# EAGLE design AD7771Breakout (EAGLE 9.6.2)
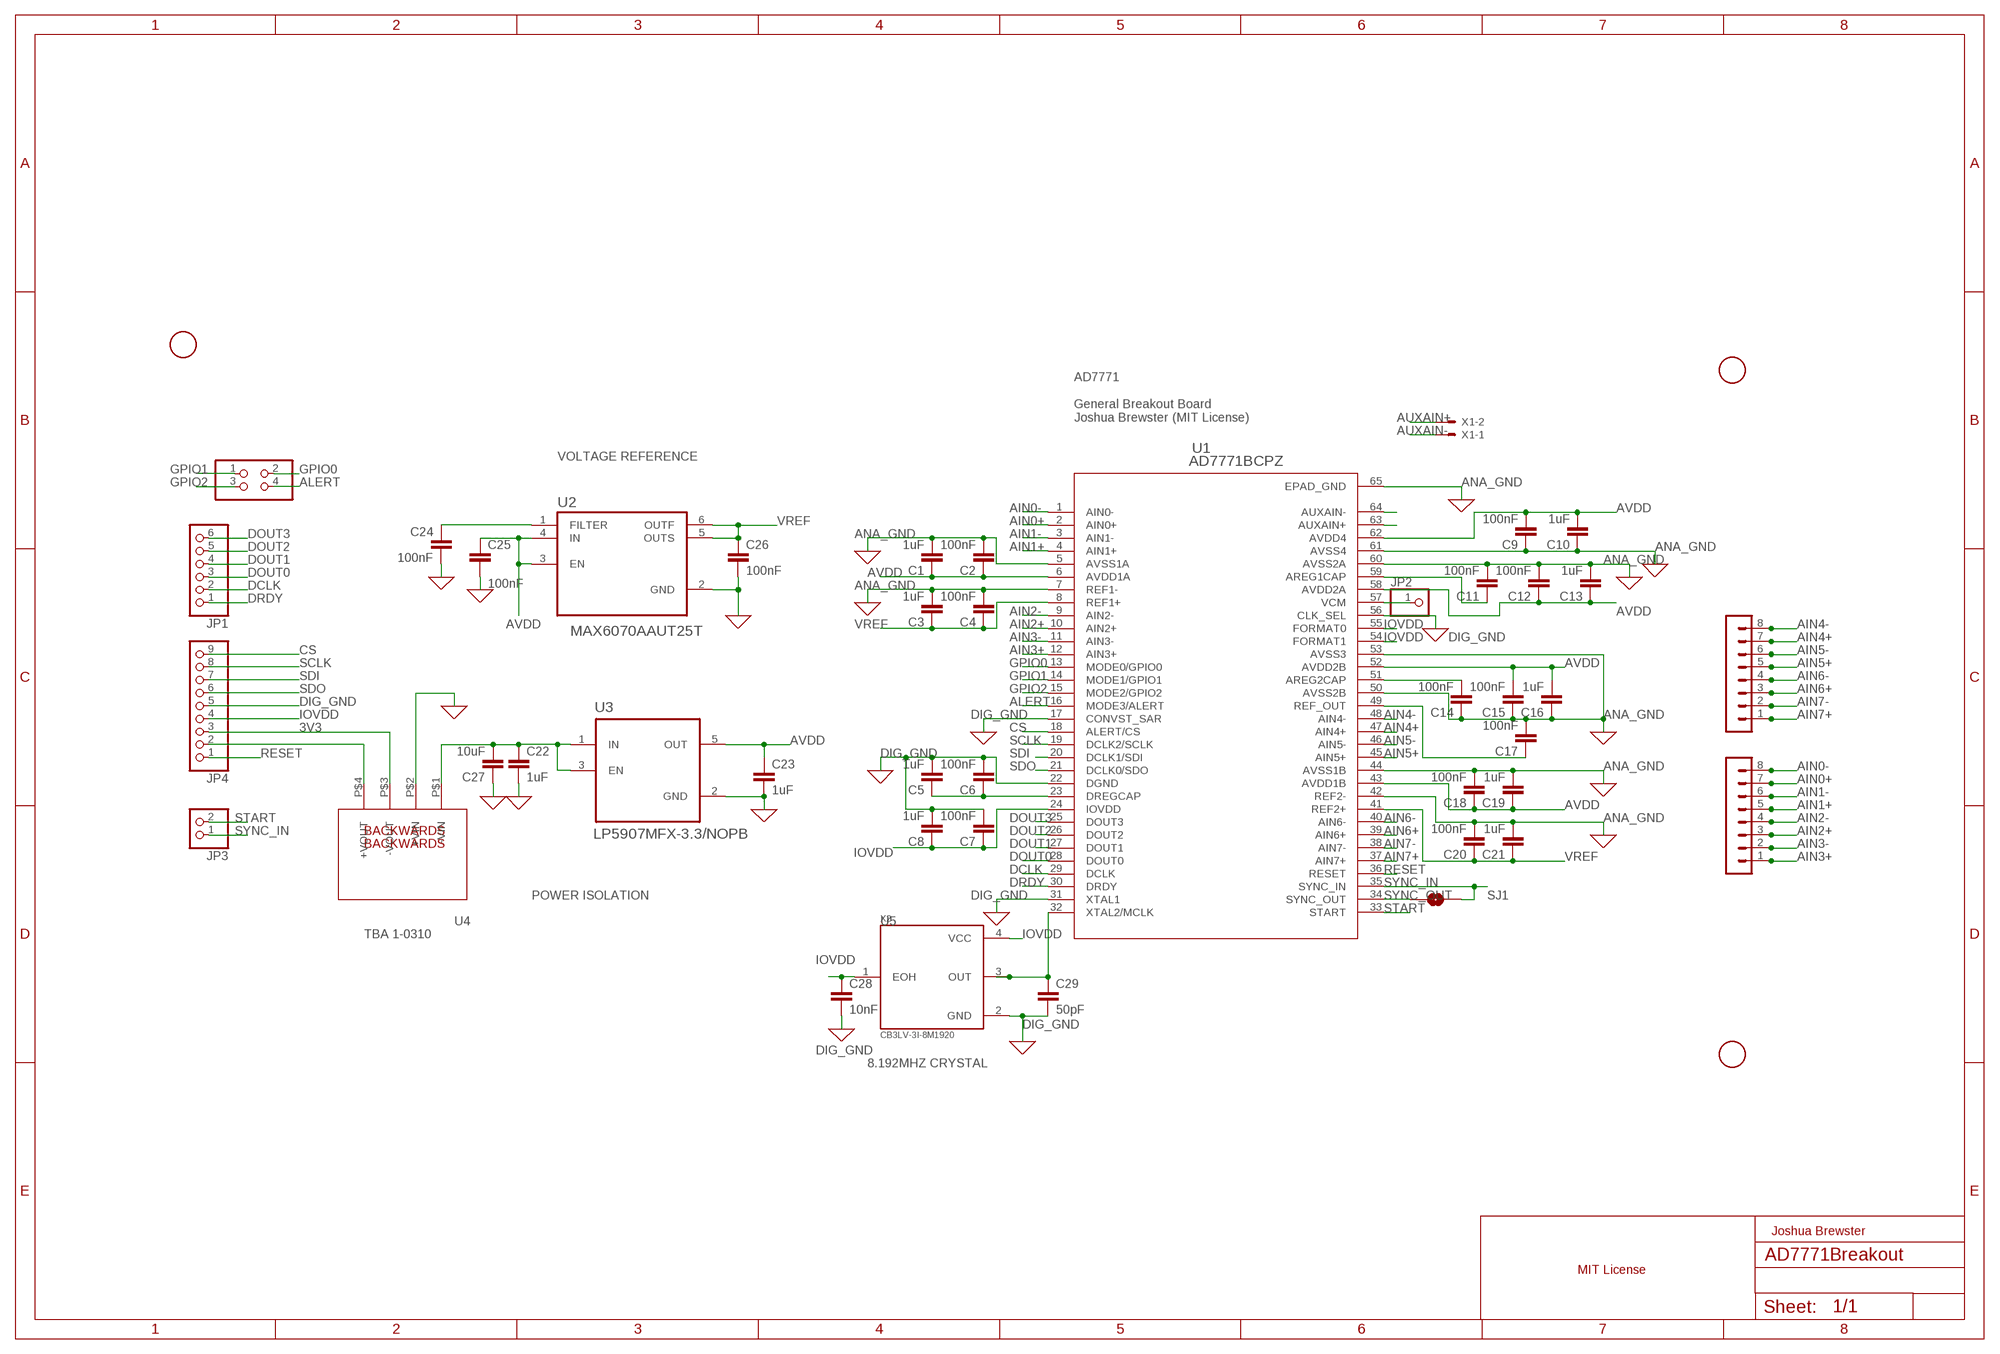
[diagram p0: schematic, sheet 1]

## Parts
C1  1uF  C-EUC0402  [C0402]
C2  100nF  C-EUC0402  [C0402]
C3  1uF  C-EUC0402  [C0402]
C4  100nF  C-EUC0402  [C0402]
C5  1uF  C-EUC0402  [C0402]
C6  100nF  C-EUC0402  [C0402]
C7  100nF  C-EUC0402  [C0402]
C8  1uF  C-EUC0402  [C0402]
C9  100nF  C-EUC0402  [C0402]
C10  1uF  C-EUC0402  [C0402]
C11  100nF  C-EUC0402  [C0402]
C12  100nF  C-EUC0402  [C0402]
C13  1uF  C-EUC0402  [C0402]
C14  100nF  C-EUC0402  [C0402]
C15  100nF  C-EUC0402  [C0402]
C16  1uF  C-EUC0402  [C0402]
C17  100nF  C-EUC0402  [C0402]
C18  100nF  C-EUC0402  [C0402]
C19  1uF  C-EUC0402  [C0402]
C20  100nF  C-EUC0402  [C0402]
C21  1uF  C-EUC0402  [C0402]
C22  1uF  C-EUC0402  [C0402]
C23  1uF  C-EUC0402  [C0402]
C24  100nF  C-EUC0402  [C0402]
C25  100nF  C-EUC0402  [C0402]
C26  100nF  C-EUC0402  [C0402]
C27  10uF  C-EUC0402  [C0402]
C28  10nF  C-EUC0402  [C0402]
C29  50pF  C-EUC0603  [C0603]
JP1  PINHD-1X6  [1X06]
JP2  PINHD-1X1  [1X01]
JP3  PINHD-1X2  [1X02]
JP4  PINHD-1X9  [1X09]
JP5  PINHD-2X2  [2X02]
SJ1  SOLDERJUMPERNC  [SJ_2S_SMALL]
SV4  MA08-1  [MA08-1]
SV5  MA08-1  [MA08-1]
U1  AD7771BCPZ  [CP_64_15_ADI]
U2  MAX6070AAUT25T  [SOT95P280X145-6N]
U3  LP5907MFX-3.3/NOPB  [SOT95P280X145-5N]
U4  TBA1-0310  [SIP4-KT]
U$1  FIDUCIAL  [FIDUCIAL_1MM]
U$2  FIDUCIAL  [FIDUCIAL_1MM]
U$5  FIDUCIAL  [FIDUCIAL_1MM]
X1  332-02  [332-02]
X2  CB3LV-3I-8M1920  [OSCCC700X500X180-4N]

## Nets
3V3: JP4.3 U4.P$3(-VOUT)
AGND_OUT: JP4.2 U4.P$4(+VOUT)
AIN0+: SV4.7 U1.2(AIN0+)
AIN0-: SV4.8 U1.1(AIN0-)
AIN1+: SV4.5 U1.4(AIN1+)
AIN1-: SV4.6 U1.3(AIN1-)
AIN2+: SV4.3 U1.10(AIN2+)
AIN2-: SV4.4 U1.9(AIN2-)
AIN3+: SV4.1 U1.12(AIN3+)
AIN3-: SV4.2 U1.11(AIN3-)
AIN4+: SV5.7 U1.47(AIN4+)
AIN4-: SV5.8 U1.48(AIN4-)
AIN5+: SV5.5 U1.45(AIN5+)
AIN5-: SV5.6 U1.46(AIN5-)
AIN6+: SV5.3 U1.39(AIN6+)
AIN6-: SV5.4 U1.40(AIN6-)
AIN7+: SV5.1 U1.37(AIN7+)
AIN7-: SV5.2 U1.38(AIN7-)
ALERT: JP5.4 U1.16(MODE3/ALERT)
ANA_GND: C1.2 C2.2 C3.2 C4.2 C9.1 C10.1 C11.2 C12.2 C13.2 C14.1 C15.1 C16.1 C17.2 C18.2 C19.2 C20.2 C21.2 C22.2 C23.2 C24.2 C25.2 C26.2 C27.1 U1.5(AVSS1A) U1.7(REF1-) U1.42(REF2-) U1.44(AVSS1B) U1.50(AVSS2B) U1.53(AVSS3) U1.60(AVSS2A) U1.61(AVSS4) U1.65(EPAD_GND) U2.2(GND) U3.2(GND) U4.P$2(+VIN) ; supply symbol labelled GND
AREG1CAP: C11.1 U1.59(AREG1CAP)
AREG2CAP: C14.2 U1.51(AREG2CAP)
AUXAIN+: U1.63(AUXAIN+) X1.2
AUXAIN-: U1.64(AUXAIN-) X1.1
AVDD: C1.1 C2.1 C9.2 C10.2 C12.1 C13.1 C15.2 C16.2 C18.1 C19.1 C23.1 C25.1 U1.6(AVDD1A) U1.43(AVDD1B) U1.52(AVDD2B) U1.58(AVDD2A) U1.62(AVDD4) U2.3(EN) U2.4(IN) U3.5(OUT)
CS: JP4.9 U1.18(ALERT/CS)
DCLK: JP1.2 U1.29(DCLK)
DIG_GND: C5.2 C6.2 C7.2 C8.2 C28.2 C29.2 JP4.5 U1.17(CONVST_SAR) U1.22(DGND) U1.31(XTAL1) U1.56(CLK_SEL) X2.2(GND) ; supply symbol labelled GND
DOUT0: JP1.3 U1.28(DOUT0)
DOUT1: JP1.4 U1.27(DOUT1)
DOUT2: JP1.5 U1.26(DOUT2)
DOUT3: JP1.6 U1.25(DOUT3)
DRDY: JP1.1 U1.30(DRDY)
DREGCAP: C5.1 C6.1 U1.23(DREGCAP)
FILTER: C24.1 U2.1(FILTER)
GPIO0: JP5.2 U1.13(MODE0/GPIO0)
GPIO1: JP5.1 U1.14(MODE1/GPIO1)
GPIO2: JP5.3 U1.15(MODE2/GPIO2)
IOVDD: C7.1 C8.1 C28.1 JP4.4 U1.24(IOVDD) U1.54(FORMAT1) U1.55(FORMAT0) X2.1(EOH) X2.4(VCC)
REF_OUT: C17.1 U1.49(REF_OUT)
RESET: JP4.1 U1.36(RESET)
SCLK: JP4.8 U1.19(DCLK2/SCLK)
SDI: JP4.7 U1.20(DCLK1/SDI)
SDO: JP4.6 U1.21(DCLK0/SDO)
START: JP3.2 U1.33(START)
SYNC_IN: JP3.1 SJ1.2 U1.35(SYNC_IN)
SYNC_OUT: SJ1.1 U1.34(SYNC_OUT)
VCM: JP2.1 U1.57(VCM)
VOUT+: C22.1 C27.2 U3.1(IN) U3.3(EN) U4.P$1(-VIN)
VREF: C3.1 C4.1 C20.1 C21.1 C26.1 U1.8(REF1+) U1.41(REF2+) U2.5(OUTS) U2.6(OUTF)
XTAL2: C29.1 U1.32(XTAL2/MCLK) X2.3(OUT)

## Notes on the sheet
- AD7771
  
  General Breakout Board 
  Joshua Brewster (MIT License)
- VOLTAGE REFERENCE
- BACKWARDS
- BACKWARDS
- POWER ISOLATION
- U4 | U5
- TBA 1-0310
- 8.192MHZ CRYSTAL
- Joshua Brewster
- MIT License

## Library data of the parts
C1-C29 = rcl:C-EU: CAPACITOR, European symbol; SPICEPREFIX: C
JP1 = pinhead:PINHD-1X6: PIN HEADER
JP2 = pinhead:PINHD-1X1: PIN HEADER
JP3 = pinhead:PINHD-1X2: PIN HEADER
JP4 = pinhead:PINHD-1X9: PIN HEADER
JP5 = pinhead:PINHD-2X2: PIN HEADER
SJ1 = headers:SOLDERJUMPER: Solder Jumper Standard SMD solder jumper. Used to automate production. Two varients : Normally Open and Normally Closed are the same, but have different paste layers. NC will have a large amount of paste and should jumper during reflow.
SV4 SV5 = con-lstb:MA08-1: PIN HEADER; OC_FARNELL: unknown; OC_NEWARK: unknown
U1 = AD7771:AD7771BCPZ; BUILT_BY: Analog Devices Inc.; MANUFACTURER_PART_NUMBER: AD7771BCPZ; SOURCELIBRARY: Analog_2017-10-24; VENDOR: Analog Devices Inc
U2 = MAX6070AAUT25T:MAX6070AAUT25T; AVAILABILITY: Unavailable; DESCRIPTION: Series Voltage Reference IC ±0.04% SOT-23-6; MF: Maxim Integrated; MP: MAX6070AAUT25+; PACKAGE: SOT-6 Maxim; PRICE: None
U3 = LP5907MFX-3.3_NOPB:LP5907MFX-3.3/NOPB: IC REG LINEAR 3.3V 250MA SOT23; AVAILABILITY: Unavailable; DESCRIPTION: Linear Voltage Regulator IC 1 Output 250mA SOT-23-5; MF: Texas Instruments; MP: LP5907MFX-3.3/NOPB; PACKAGE: SOT-23 Texas Instruments; PRICE: None
U4 = TBA1-0310:TBA1-0310
U$1 U$2 U$5 = adafruit:FIDUCIAL: For use by pick and place machines to calibrate the vision/machine, 1mm By microbuilder.eu
X1 = con-garry:332-02: 2 Pin - 2mm Dual Row Source: www.mpe-connector.de / garry_shortform_2012.pdf
X2 = CB3LV-3I-8M1920:CB3LV-3I-8M1920: Oscillator XO 50MHz 50ppm 50pF HCMOS/TTL 55% 3.3V 4-Pin SMD T/R; AVAILABILITY: Unavailable; DESCRIPTION: 8.192MHz XO _Standard_ HCMOS, TTL Oscillator 3.3V Enable/Disable 4-SMD, No Lead; MF: CTS-Frequency; MP: CB3LV-3I-8M1920; PACKAGE: SMD-4 CTS Components; PRICE: None

## Board
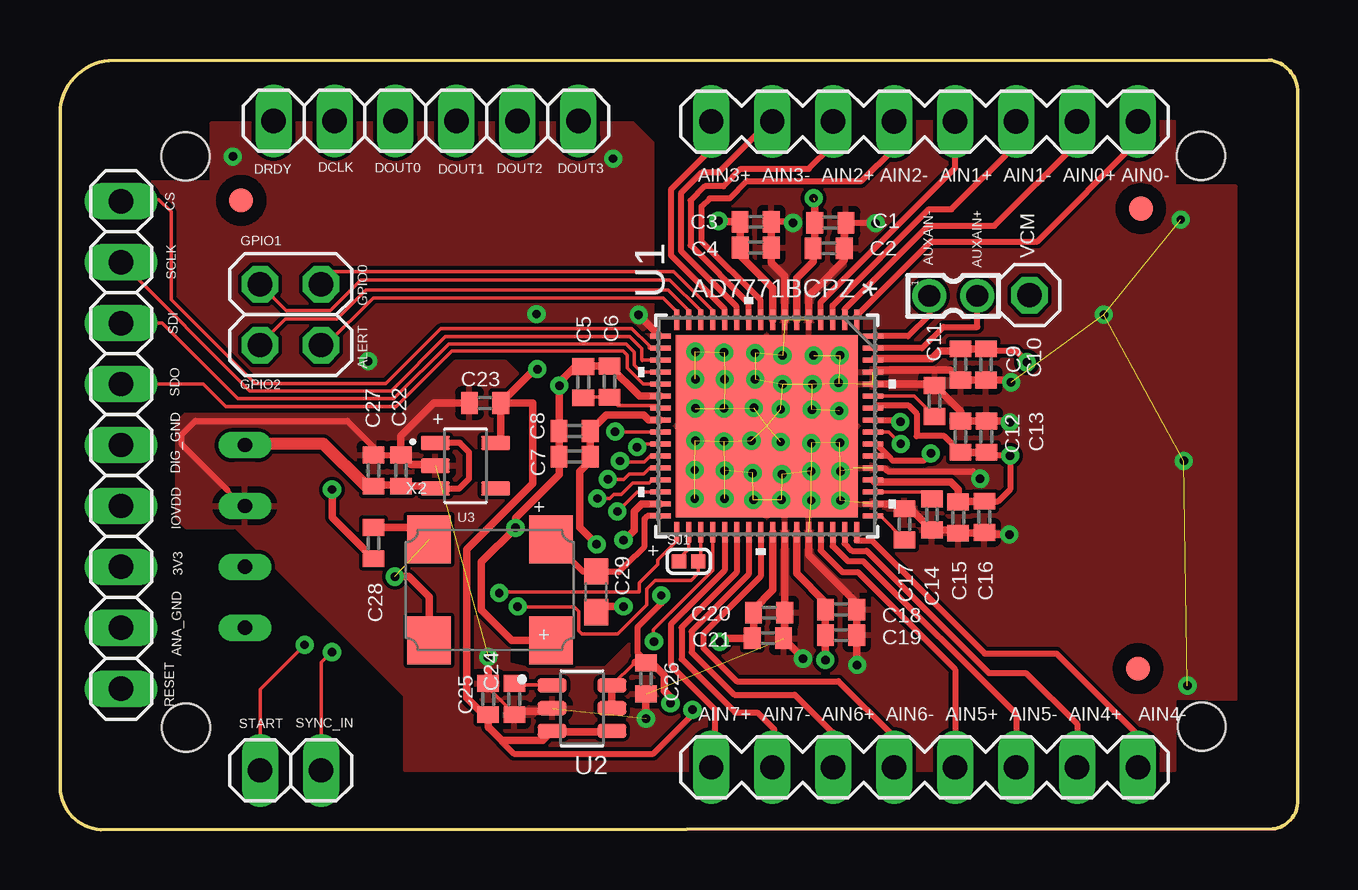
[diagram p1: board, top side]
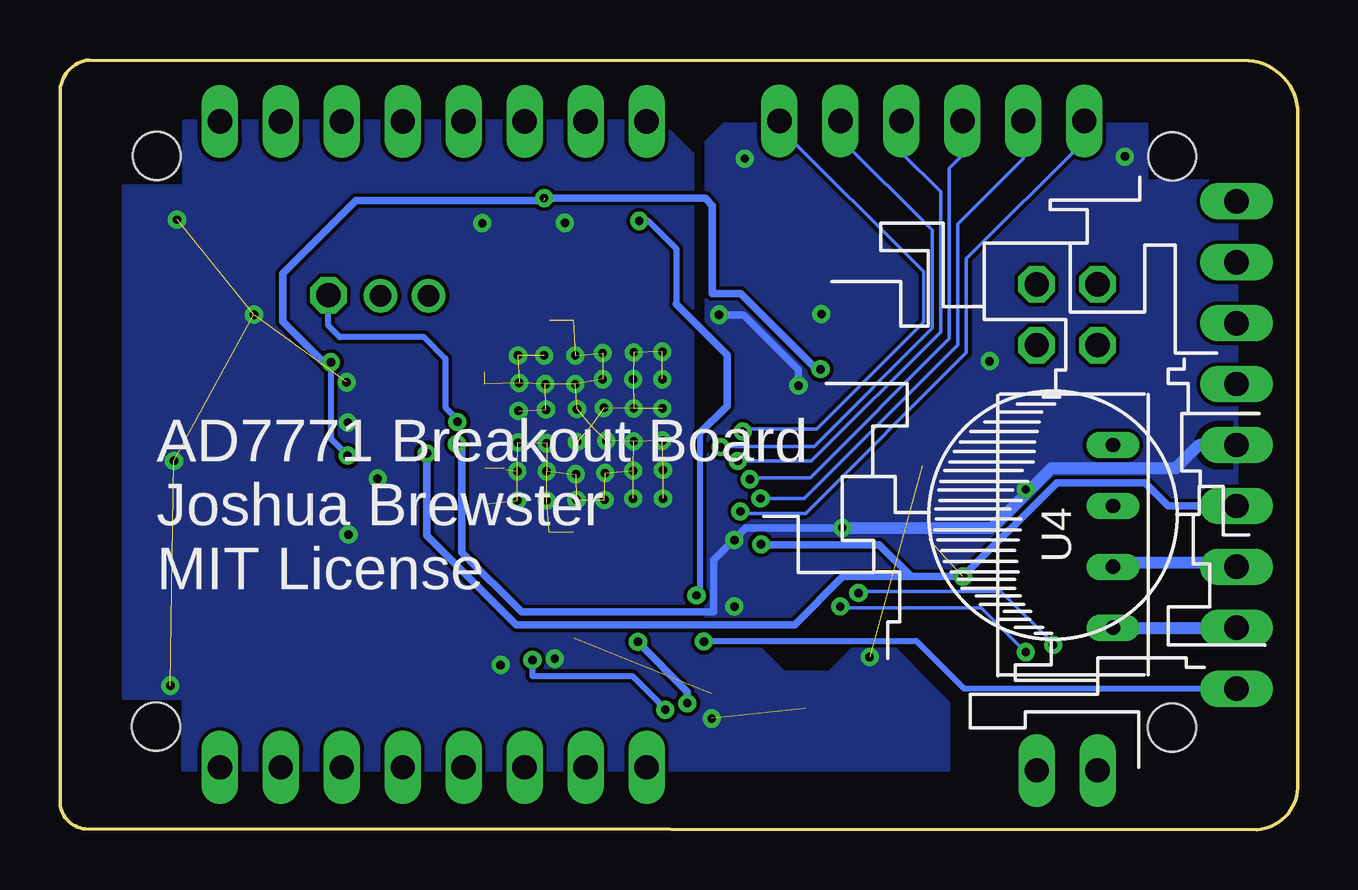
[diagram p2: board, bottom side, seen from below]

Size 51.58 x 32.09 mm. Coordinates in mm from the lower left corner, seen from the top.
Outline: 1.7,0 50.53,0.03 arc90 51.57,1.32 51.57,30.58 arc90 50.36,32.09 2.04,32.06 arc90 0.01,29.65 0.01,1.91 arc90 1.7,0
Copper layers (1*16): Top 0.035mm / dielectric 1.5mm / Bottom 0.035mm
Design rules "default *": minimum track width 6mil, minimum drill 0.3mm, track to track 6mil, track to pad 6mil, pad to pad 6mil, via to via 6mil, smd to smd 6mil, copper to edge 0mil, drill to drill 6mil, minimum pad ring 10mil, minimum via ring 8mil, stop-mask expansion 4mil, vias tented up to drill 0mil, thermal gap 10mil
Holes 2 mm at 47.57,4.3 47.54,28.08 5.23,28.06 5.25,4.26

### Footprints (pad centres in the part's own frame; a part is rotated, then mirrored left to right if it is on the bottom)
C0402 = smd 0.7 x 0.9: 1 -0.65,0; 2 0.65,0
C0603 = smd 1.1 x 1: 1 -0.85,0; 2 0.85,0
1X06 = drill 1.016 long: 1 -6.35,0; 2 -3.81,0; 3 -1.27,0; 4 1.27,0; 5 3.81,0; 6 6.35,0
1X01 = drill 1.016 octagon: 1 0,0
1X02 = drill 1.016 long: 1 -1.27,0; 2 1.27,0
1X09 = drill 1.016 long: 1 -10.16,0; 2 -7.62,0; 3 -5.08,0; 4 -2.54,0; 5 0,0; 6 2.54,0; 7 5.08,0; 8 7.62,0; 9 10.16,0
2X02 = drill 1.016 octagon: 1 -1.27,-1.27; 2 -1.27,1.27; 3 1.27,-1.27; 4 1.27,1.27
SJ_2S_SMALL = smd 0.6 x 0.6: 1 -0.4,0; 2 0.4,0
MA08-1 = drill 1.016 long: 1 -8.89,0; 2 -6.35,0; 3 -3.81,0; 4 -1.27,0; 5 1.27,0; 6 3.81,0; 7 6.35,0; 8 8.89,0
CP_64_15_ADI = smd 0.855 x 0.198: 1 -4.427,3.75; 2 -4.427,3.25; 3 -4.427,2.75; 4 -4.427,2.25; 5 -4.427,1.75; 6 -4.427,1.25; 7 -4.427,0.75; 8 -4.427,0.25; 9 -4.427,-0.25; 10 -4.427,-0.75; 11 -4.427,-1.25; 12 -4.427,-1.75; 13 -4.427,-2.25; 14 -4.427,-2.75; 15 -4.427,-3.25; 16 -4.427,-3.75; 33 4.427,-3.75; 34 4.427,-3.25; 35 4.427,-2.75; 36 4.427,-2.25; 37 4.427,-1.75; 38 4.427,-1.25; 39 4.427,-0.75; 40 4.427,-0.25; 41 4.427,0.25; 42 4.427,0.75; 43 4.427,1.25; 44 4.427,1.75; 45 4.427,2.25; 46 4.427,2.75; 47 4.427,3.25; 48 4.427,3.75 | smd 0.198 x 0.855: 17 -3.75,-4.427; 18 -3.25,-4.427; 19 -2.75,-4.427; 20 -2.25,-4.427; 21 -1.75,-4.427; 22 -1.25,-4.427; 23 -0.75,-4.427; 24 -0.25,-4.427; 25 0.25,-4.427; 26 0.75,-4.427; 27 1.25,-4.427; 28 1.75,-4.427; 29 2.25,-4.427; 30 2.75,-4.427; 31 3.25,-4.427; 32 3.75,-4.427; 49 3.75,4.427; 50 3.25,4.427; 51 2.75,4.427; 52 2.25,4.427; 53 1.75,4.427; 54 1.25,4.427; 55 0.75,4.427; 56 0.25,4.427; 57 -0.25,4.427; 58 -0.75,4.427; 59 -1.25,4.427; 60 -1.75,4.427; 61 -2.25,4.427; 62 -2.75,4.427; 63 -3.25,4.427; 64 -3.75,4.427 | smd 7.6 x 7.6: 65 0,0
SOT95P280X145-6N = smd 1.22 x 0.6: 1 -1.245,0.95; 2 -1.245,0; 3 -1.245,-0.95; 4 1.245,-0.95; 5 1.245,0; 6 1.245,0.95
SOT95P280X145-5N = smd 1.21 x 0.59: 1 -1.255,0.95; 2 -1.255,0; 3 -1.255,-0.95; 4 1.255,-0.95; 5 1.255,0.95
SIP4-KT = drill 0.6 pad 0.813 long: P$1 -5.08,0; P$2 -2.54,0; P$3 0,0; P$4 2.54,0
FIDUCIAL_1MM = smd 1 x 1: 1 0,0
332-02 = drill 0.9 pad 1.27: 1 0,-1; 2 0,1
OSCCC700X500X180-4N = smd 1.8 x 2: 1 -2.54,-2.1; 2 2.54,-2.1; 3 2.54,2.1; 4 -2.54,2.1

### Placement (x,y rotation side)
C1  32.1,25.3 0 top
C2  32.03,24.23 0 top
C3  28.98,25.34 0 top
C4  28.99,24.26 0 top
C5  21.8,18.65 90 top
C6  22.89,18.67 90 top
C7  21.45,15.55 180 top
C8  21.45,16.62 180 top
C9  37.52,19.39 90 top
C10  38.58,19.39 90 top
C11  36.44,17.87 90 top
C12  37.52,16.38 90 top
C13  38.6,16.38 90 top
C14  36.33,13.14 90 top
C15  37.42,13.01 90 top
C16  38.51,13.04 90 top
C17  35.19,12.73 90 top
C18  32.55,9.17 0 top
C19  32.55,8.11 0 top
C20  29.55,9.05 0 top
C21  29.5,7.98 0 top
C22  14.21,14.97 90 top
C23  17.71,17.79 180 top
C24  18.93,5.44 270 top
C25  17.84,5.44 90 top
C26  24.42,6.3 270 top
C27  13.06,14.97 270 top
C28  13.06,11.94 270 top
C29  22.33,9.91 270 top
JP1  15.25,29.55 0 top
JP2  40.39,22.28 0 top
JP3  9.61,2.47 180 top
JP4  2.55,16.03 90 top
JP5  9.61,21.47 270 top
SJ1  26.2,11.18 0 top
SV4  36.03,29.52 0 top
SV5  36.03,2.6 0 top
U1  29.45,16.82 270 top
U2  21.75,5.06 0 top
U3  16.9,15.17 0 top
U4  7.7,10.95 270 bottom
U$1  45.03,25.89 0 top
U$2  44.92,6.71 0 top
U$5  7.55,26.23 0 top
X1  37.22,22.26 270 top
X2  17.92,9.99 0 top

### Tracks (layer width: path | path; a pad name or v marks a point on that pad's centre or on a via)
3V3
  Bottom 0.508: JP4.3 2.73,11.13 7.37,11.13 7.55,10.95 U4.P$3
AGND_OUT
  Bottom 0.508: 2.6,8.46 JP4.2 U4.P$4
AIN0+
  Top 0.254: U1.2 32.7,21.7 36.18,25.18 38.93,25.18 42.38,28.62 SV4.7
AIN0-
  Top 0.152: U1.1 33.2,21.43
  Top 0.254: SV4.8 44.92,28.71 40.72,24.52 36.28,24.52 33.2,21.43
AIN1+
  Top 0.254: U1.4 31.7,21.99 37.3,27.59 SV4.5
AIN1-
  Top 0.254: U1.3 32.2,21.86 36.2,25.86 37.14,25.86 39.84,28.55 SV4.6
AIN2+
  Top 0.152: SV4.3 32.13,29.43
  Top 0.254: U1.10 28.7,21.94 26.27,24.36 26.27,26.23 26.87,26.82 27.65,26.82 28.37,27.55 31.2,27.55 32.13,28.48 32.13,29.43
AIN2-
  Top 0.254: U1.9 29.2,22.07 26.73,24.54 26.73,25.98 27.07,26.31 27.9,26.31 28.62,27.03 33.39,27.03 34.76,28.4 SV4.4
AIN3+
  Top 0.152: 27.14,28.9 27.13,28.89
  Top 0.254: U1.12 27.7,21.69 25.46,23.93 25.46,26.69 27.13,28.36 27.13,28.89 | SV4.1 27.14,28.9
AIN3-
  Top 0.152: SV4.2 29.47,29.32
  Top 0.254: U1.11 28.2,21.8 25.87,24.14 25.87,26.53 26.73,27.39 27.43,27.39 29.36,29.32 29.47,29.32
AIN4+
  Top 0.254: U1.47 32.7,11.92 32.99,11.63 33.61,11.63 38.7,6.53 40.24,6.53 42.38,4.4 SV5.7
AIN4-
  Top 0.254: U1.48 33.2,12.04 33.83,12.04 38.53,7.35 41.52,7.35 44.92,3.95 SV5.8
AIN5+
  Top 0.254: U1.45 31.7,11.64 32.6,10.74 33.24,10.74 37.3,6.68 SV5.5
AIN5-
  Top 0.254: U1.46 32.2,11.82 32.83,11.19 33.46,11.19 39.84,4.82 SV5.6
AIN6+
  Top 0.254: U1.39 28.7,10.63 26.32,8.25 26.32,7.4 28.1,5.62 30.61,5.62 32.22,4.01
  Top 0.305: 32.22,4.01 SV5.3
AIN6-
  Top 0.254: U1.40 29.2,10.55 26.81,8.15 26.81,7.57 28.2,6.18 32.43,6.18 34.76,3.86
  Top 0.305: 34.76,3.86 SV5.4
AIN7+
  Top 0.152: 27.28,2.74 SV5.1
  Top 0.254: U1.37 27.7,10.8 25.46,8.56 25.46,6.84 27.28,5.02 27.28,2.74
AIN7-
  Top 0.152: 29.78,4.15 29.78,2.7 SV5.2
  Top 0.254: U1.38 28.2,10.72 25.9,8.42 25.9,7.11 28.13,4.88 29.05,4.88 29.78,4.15
ALERT
  Top 0.152: U1.16 25.7,21.6 25.14,22.16 13.04,22.16 11.08,20.2 JP5.4
ANA_GND  (via drill 0.35)  (52 unrouted)
  Top 0.152: 31.61,22.66 | C2.2 32.68,23.73 | C3.2 | U1.61 33.95,19.07 | 36.39,18.57 C11.2 | 37.3,12.49 C15.1 | 38.49,12.36 C16.1 38.6,12.3 | U1.50 | 33.06,15.07 33,15.02 | 14.56,15.27 C22.2 | 19.08,4.94 C24.2 | C20.2 | 39.54,18.74 v39.63,18.65 | 18.93,4.82 17.84,5.91 C25.2 | 33.2,6.88 v33.22,6.86 | 24.4,4.64 v24.42,4.63 | C18.2 33.2,9.45 | C27.1 13.39,15.62 | 6.97,14.15 7.63,13.49 U4.P$2
  Top 0.254: C22.2 13.39,15.62 11.97,17.04 5.64,17.04 5.08,16.47 5.08,16.05 6.97,14.15 | v30.54,25.3 30.5,25.34 C3.2 | v33.98,25.28 33.96,25.3 C1.2 | U1.53 34.36,15.07 34.49,14.94 38.03,14.94 v38.34,14.63
  Top 0.305: U1.5 31.2,22.25 31.61,22.66 32.68,23.73 | U1.7 30.2,23.08 29.64,23.64 C4.2 C3.2 | C1.2 32.68,25.23 C2.2 | 33.95,19.07 34.04,19.16 37.1,19.16 C9.1 C10.1 39.54,18.74 | U1.60 36.39,18.57 | C11.2 37.52,17.43 C12.2 C13.2 39.52,17.03 v39.58,16.97 | U1.50 35.25,13.57 C14.1 | C14.1 37.3,12.49 | C15.1 38.49,12.36 | U2.2 20.38,4.94 19.08,4.94 | C18.2 C19.2 33.2,6.88 | U1.44 31.2,11.45 33.2,9.45 | U1.42 C20.2 | C20.2 30.2,8.03 C21.2 30.15,7.94 v30.96,7.13 | C23.2 15.58,17.79 14.21,16.42 C22.2 14.61,15.21 15.6,15.21 U3.2 | v39.56,12.3 38.6,12.3 | C25.2 v17.84,7.2 | C24.2 18.93,4.82 | C26.2 24.4,5.64 24.4,4.64 | C14.1 35.44,13.38 C17.2
  other vias: 31.4,19.77 26.47,19.92 26.45,14.99 26.45,13.8 26.47,18.78 27.69,13.8 26.47,17.56 26.47,16.21 30.11,19.77 28.96,19.87 27.67,19.89 27.69,18.78 27.67,17.56 27.67,16.18 27.69,14.97 28.89,13.75 28.86,14.86 28.81,16.21 28.91,17.58 28.96,18.78 30.11,18.57 30.03,17.53 30.03,16.16 30.08,14.81 30.06,13.75 31.3,13.72 31.3,14.94 31.3,16.11 32.49,16.13 32.52,14.94 32.52,13.72 32.47,17.45 32.44,18.62 31.35,18.57 31.33,17.51 32.49,19.77 43.49,21.47 46.83,15.37 46.98,6 46.7,25.43
  pour Bottom: 14.54,2.49 14.54,5.29 17.48,8.23 17.84,8.23 19.52,6.56 21.39,6.56 23.02,8.18 24.93,8.23 25.2,8.51 25.2,28.17 26.58,29.54 46.41,29.54 46.41,26.82 48.94,26.82 48.93,5.47 46.45,5.47 46.46,3.15 46.46,2.49
  pour Top: 48.98,26.82 46.42,26.82 46.42,29.53 26.58,29.52 25.15,28.1 25.15,9.17 22.72,6.74 19.44,6.74 18.73,6.91 18.7,6.94 18.7,13.14 19.74,14.18 19.74,18.34 18.58,19.51 16.44,19.51 14.23,17.3 5.19,17.3 4.86,16.97 4.86,12.98 5.24,12.6 7.32,12.6 14.36,5.57 14.36,2.46 46.38,2.48 46.44,2.48 46.44,5.46 48.98,5.43
AREG1CAP
  Top 0.152: U1.59 35.59,18.07 C11.1
AREG2CAP
  Top 0.152: U1.51 36.05,14.07 C14.2
AUXAIN+
  Top 0.152: U1.63
  Top 0.254: U1.63 35.93,20.07 36.81,20.96 38.22,20.96 X1.2
AUXAIN-
  Top 0.254: U1.64 35.33,20.57 36.22,21.46 X1.1
AVDD  (via drill 0.35)  (1 unrouted)
  Top 0.152: C1.1 31.34,25.2 | C2.1 31.45,24.3 | U1.62 33.94,19.63 | 37.42,19.94 C9.2 | C12.1 | C15.2 37.45,13.69 | 31.9,9.48 C18.1 | 33.98,17.67 U1.58 | v31.9,7.08 v31.89,7.07 | C13.1 38.64,15.77 | v31.4,26.32 31.45,26.28
  Top 0.254: C12.1 36.85,16.4 35.69,16.4 35.69,17.34 35.36,17.67 33.98,17.67 | C16.2 39.09,13.69 39.59,14.19 v39.59,15.59 38.74,15.59 C13.1 | C25.1 17.84,4.23 18.91,3.16 24.72,3.16 26.36,4.8 v26.36,4.99 | v40.29,19.48 40.29,19.51 39.84,19.96 38.66,19.96 C10.2
  Top 0.305: U1.6 30.7,23 31.38,23.68 C2.1 | 31.45,24.3 C1.1 31.45,26.28 | 33.94,19.63 36.32,19.63 36.64,19.94 37.42,19.94 | C10.2 C9.2 | C13.1 C12.1 | U1.52 33.95,14.49 37.11,14.49 37.42,14.18 C15.2 | 37.45,13.69 C16.2 | C23.1 19.69,17.79 19.69,14.43 16.95,11.69 16.95,5.5 17.66,4.79 C25.1 17.84,4.28 18.4,3.72 20.11,3.72 U2.3 20.46,4.07 | U1.43 30.7,10.68 31.9,9.48 | U2.4 22.95,4.07 20.46,4.07 | v31.9,7.08 C19.1 C18.1 | C23.1 19.77,19.2 v19.89,19.2 | U3.5 18.36,16.33 C23.1 | 20.46,4.07 20.33,4.07
  Bottom 0.254: v31.89,7.07 31.89,6.4 27.73,6.4 26.34,5.01 v26.36,4.99 | v40.29,19.48 v40.3,19.47 40.3,16.3 v39.59,15.59
  Bottom 0.305: v31.4,26.32 24.7,26.32 24.39,26.01 24.39,22.34 23.2,22.34 20.06,19.2 v19.89,19.2 | v40.29,19.48 40.6,19.48 42.3,21.18 42.3,23.17 39.25,26.22 31.43,26.22
CS
  Top 0.152: U1.18 24.55,20.07 24.54,20.07 24.54,20.17 23.83,20.88 15.86,20.88 13.57,18.6 8.14,18.6 4.63,22.1 4.63,25.76 4.12,26.27 2.55,26.27 JP4.9
DCLK  (via drill 0.35)
  Top 0.152: U1.29 24.66,14.57 24.54,14.45 23.87,14.45 23.39,13.97 23.07,13.97 22.91,13.81 v22.39,13.81
  Bottom 0.152: v22.39,13.81 20.57,13.81 14.17,20.21 14.17,25.24 11.44,27.97 JP1.2
DIG_GND  (via drill 0.35)
  Top 0.152: 21.83,19.32 C5.2 21.47,19.3 | U1.17 25,20.57 | v20.81,18.51 20.81,18.63 | C8.2 | U1.56 34.52,16.57 35.01,16.08 v35.03,16.08
  Top 0.305: U1.22 24.15,18.07 C6.2 21.83,19.32 | C8.2 C7.2 20.8,14.81 18.98,13 v18.98,12.58 17.56,11.16 17.56,9.15 18.82,7.89 X2.2 | 25,20.57 v24.11,21.46 | 21.47,19.3 20.81,18.63 | C8.2 v20.81,18.51 | U1.31 24.24,13.57 23.93,13.26 23.93,12.47 23.52,12.07 v23.48,12.07 | C29.2 22.58,9.3 v23.48,9.3 | C28.2 11.34,13.02 v11.34,14.18
  Bottom 0.305: v24.11,21.46 23.08,21.46 20.81,19.18 v20.81,18.51 | v35.03,16.08 | v18.98,12.58 23,12.58 24.34,11.23 24.34,9.07 32.34,9.07 34.83,11.56 34.83,15.88 v35.03,16.08
  Bottom 0.508: v18.98,12.58 12.76,12.58 10.26,15.07 5.08,15.07 4.12,16.03 JP4.5
  other vias: 7.2,28.06 12.84,19.53 23.05,27.97 19.85,21.49
  pour Bottom: 14.18,2.49 14.18,5.39 17.41,8.62 24.65,8.62 24.65,28.68 23.92,29.4 6.3,29.41 6.3,27.02 2.55,27.02 2.55,8.99 2.54,6.3 2.54,5.44 6.44,5.44 6.44,2.49
  pour Top: 2.65,17.73 14.21,17.73 16.31,19.84 24.27,19.84 24.7,20.27 24.7,28.63 23.89,29.44 6.3,29.44 6.3,26.99 2.65,26.99
DOUT0  (via drill 0.35)
  Top 0.152: U1.28 24.57,15.08 24.32,14.82 23.71,14.82 23.49,14.6 v22.83,14.6
  Bottom 0.152: v22.83,14.6 22.77,14.67 20.32,14.67 14.52,20.47 14.52,27.58 13.98,28.12 JP1.3
DOUT1  (via drill 0.35)
  Top 0.152: U1.27 24.59,15.57 24.35,15.33 23.33,15.33 v23.33,15.37
  Bottom 0.152: v23.33,15.37 23.33,15.36 20.27,15.36 14.89,20.74 14.89,26.59 16.52,28.22 JP1.4
DOUT2  (via drill 0.35)
  Top 0.152: U1.26 24.17,16.07 v24.05,15.95
  Bottom 0.152: v24.05,15.95 24.01,15.98 20.16,15.98 15.23,20.9 15.23,24.98 19.06,28.81 JP1.5
DOUT3  (via drill 0.35)
  Top 0.152: U1.25 23.15,16.57 v23.13,16.59
  Bottom 0.152: v23.13,16.59 23.03,16.69 20.05,16.69 15.59,21.15 15.59,23.26 21.6,29.27 JP1.6
DRDY  (via drill 0.35)
  Top 0.152: U1.30 24.05,14.07 23.24,13.26 v23.23,13.26
  Bottom 0.152: v23.23,13.26 23.23,13.24 23.17,13.19 20.5,13.19 13.81,19.88 13.81,23.79 8.9,28.71 JP1.1
DREGCAP
  Top 0.152: U1.23 24.92,17.67 23.25,17.67 C6.1 21.83,18.02 C5.1
FILTER
  Top 0.152: U2.1 20.48,6.04 18.98,6.04 C24.1
GPIO0
  Top 0.152: U1.13 27.2,21.65 25.58,23.27 11.41,23.27 JP5.2
GPIO1
  Top 0.152: U1.14 26.7,21.63 25.42,22.91 12.52,22.91 11.26,21.65 9.43,21.65 JP5.1
GPIO2
  Top 0.152: U1.15 26.2,21.64 25.34,22.5 12.75,22.5 11.54,21.29 9.38,21.29 8.34,20.25 JP5.3
IOVDD  (via drill 0.35)  (1 unrouted)
  Top 0.152: C7.1 22.1,15.36 | 34.52,15.57 | U1.55 34.02,16.07
  Top 0.254: U1.54 34.52,15.57 34.02,16.07 | v36.29,15.68 35.98,15.37 34.72,15.37 34.52,15.57
  Top 0.305: U1.24 24.54,17.07 24.33,17.28 22.76,17.28 C8.1 C7.1 | 22.1,15.36 21.66,14.92 21.66,12.59 v22.36,11.89 | v13.95,10.55 14.53,10.55 15.38,9.71 X2.1 | X2.4 15.38,12.59 C28.1
  Bottom 0.305: JP4.4 5.39,13.49 6.36,14.46 10.04,14.46 v13.95,10.55 16.11,10.55 | 16.11,10.55 18.96,10.55 20.96,8.54 32.57,8.54 36.29,12.26 v36.29,15.68 | v22.36,11.89 22.34,11.87 17.64,11.87 17.43,11.87 16.11,10.55
REF_OUT
  Top 0.152: U1.49 34.2,13.07 C17.1
RESET  (via drill 0.35)
  Top 0.152: U1.36 27.2,10.81 24.72,8.33 24.72,7.87 v24.75,7.84
  Bottom 0.254: v24.75,7.84 24.72,7.87 15.9,7.87 13.9,5.87 JP4.1
SCLK
  Top 0.152: U1.19 24.27,19.57 24.27,19.56 24.24,19.59 24.24,20.04 23.73,20.55 16.06,20.55 13.8,18.29 7.91,18.29 JP4.8
SDI
  Top 0.152: U1.20 24.22,19.07 23.94,19.36 23.94,19.92 23.6,20.25 16.19,20.25 13.91,17.98 7.41,17.98 4.27,21.11 JP4.7
SDO
  Top 0.152: U1.21 24.29,18.57 23.63,19.23 23.63,19.79 23.48,19.94 16.32,19.94 14,17.63 6.91,17.63 5.97,18.57 JP4.6
START  (via drill 0.35)
  Top 0.152: U1.33 25.7,12.04 24.9,11.24 24.9,11.06 24.14,10.29 24.14,9.91 18.35,9.91 v18.3,9.86 | v10.19,7.7 8.34,5.85 JP3.2
  Bottom 0.152: v18.3,9.86 18.23,9.93 12.37,9.93 10.19,7.75 v10.19,7.7
SYNC_IN  (via drill 0.35)
  Top 0.152: 26.7,11.81 26.7,11.82 | 26.7,11.82 26.7,12.39 U1.35 | 26.7,11.82 26.7,11.29 SJ1.2 26.6,10.69 26.3,10.39 24.8,10.39 24.44,10.04 24.44,9.36 23.24,8.16 21.74,8.16 21.61,8.29 21.61,9.1 21.42,9.28 19.08,9.28 v19.07,9.3 | v11.34,7.4 11.31,7.4 10.88,6.96 JP3.1
  Bottom 0.152: v19.07,9.3 19.02,9.25 13.19,9.25 v11.34,7.4
SYNC_OUT
  Top 0.152: U1.34 26.2,11.71 25.81,11.32 25.81,11.2 SJ1.1 25.69,11.18
VCM  (via drill 0.35)
  Top 0.152: 34.98,17 34.91,17.07
  Top 0.254: U1.57 34.91,17.07 | v35.02,17 34.98,17
  Bottom 0.152: v35.02,17 35.02,17.1
  Bottom 0.254: JP2.1 40.39,21.01 39.91,20.53 36.41,20.53 35.52,19.64 35.52,17.6 35.02,17.1
VOUT+
  Top 0.152: 14.16,14.36 C22.1
  Top 0.254: U3.3 16.64,14.22 17.05,14.64 17.05,15.73 16.66,16.12 U3.1
  Top 0.305: C22.1 14.22,14.33 15.53,14.33 U3.3 | 14.16,14.36 13.11,14.36 C27.2
  Top 0.508: C27.2 12.75,14.32 10.98,16.08 7.76,16.08 U4.P$1 | C22.1
VREF  (via drill 0.35)
  Top 0.152: 28.34,23.94 C4.1 | C3.1 | 28.9,8.03 C21.1 | C26.1 24.39,6.98 | U2.6 23.96,6.98 | C20.1 28.9,9.18 | C26.1 24.31,6.85 | 24.65,6.95 24.49,6.95 C26.1 | 27.48,25.34 v27.44,25.38
  Top 0.254: v25.05,9.76 25.05,9.43 24.06,8.43 24.06,7.39 24.49,6.95
  Top 0.305: U1.8 29.7,22.58 28.34,23.94 | C3.1 C4.1 | U2.5 U2.6 | C20.1 28.9,8.03 | 24.39,6.98 23.96,6.98 | 28.9,9.18 29.7,9.98 U1.41 | C21.1 27.64,7.98 v27.49,7.83 | v25.44,5.27 25.44,5.51 25.18,5.78 25.18,6.43 24.65,6.95 | C3.1 27.48,25.34
  Bottom 0.152: v27.49,7.83 27.49,7.8
  Bottom 0.254: v27.44,25.38 27.06,25.38 25.89,24.21 25.89,21.9 | 24.92,16.53 24.92,9.9 v25.05,9.76
  Bottom 0.305: 27.49,7.8 25.44,5.75 v25.44,5.27 | 24.92,16.53 23.78,17.66 23.78,19.79 25.89,21.9
XTAL2
  Top 0.254: U1.32 24.48,13.07 24.36,12.96 24.36,11.81 23.58,11.03 | 23.58,11.03 23.29,10.74 22.36,10.74 C29.1 21.78,10.76 X2.3 | 23.58,11.03

### Text on the board
tPlace: AUXAIN- | VCM | AUXAIN+ | + | + | + | +
tNames: DRDY | DCLK | DOUT0 | DOUT1 | DOUT2 | DOUT3 | AIN3+ AIN3- AIN2+ AIN2- AIN1+ AIN1- AIN0+ AIN0- | CS | GPIO1 | SCLK | GPIO0 | SDI | ALERT | SDO | GPIO2 | DIG_GND | IOVDD | 3V3 | ANA_GND | RESET | SYNC_IN | AIN7+ AIN7- AIN6+ AIN6- AIN5+ AIN5- AIN4+ AIN4- | START
bNames: AD7771 Breakout Board / Joshua Brewster / MIT License
Document: AD7771 Breakout (WIP) / Joshua Brewster (MIT License) | TODO: / VERIFY COMPONENTS / VERIFY LAYOUT